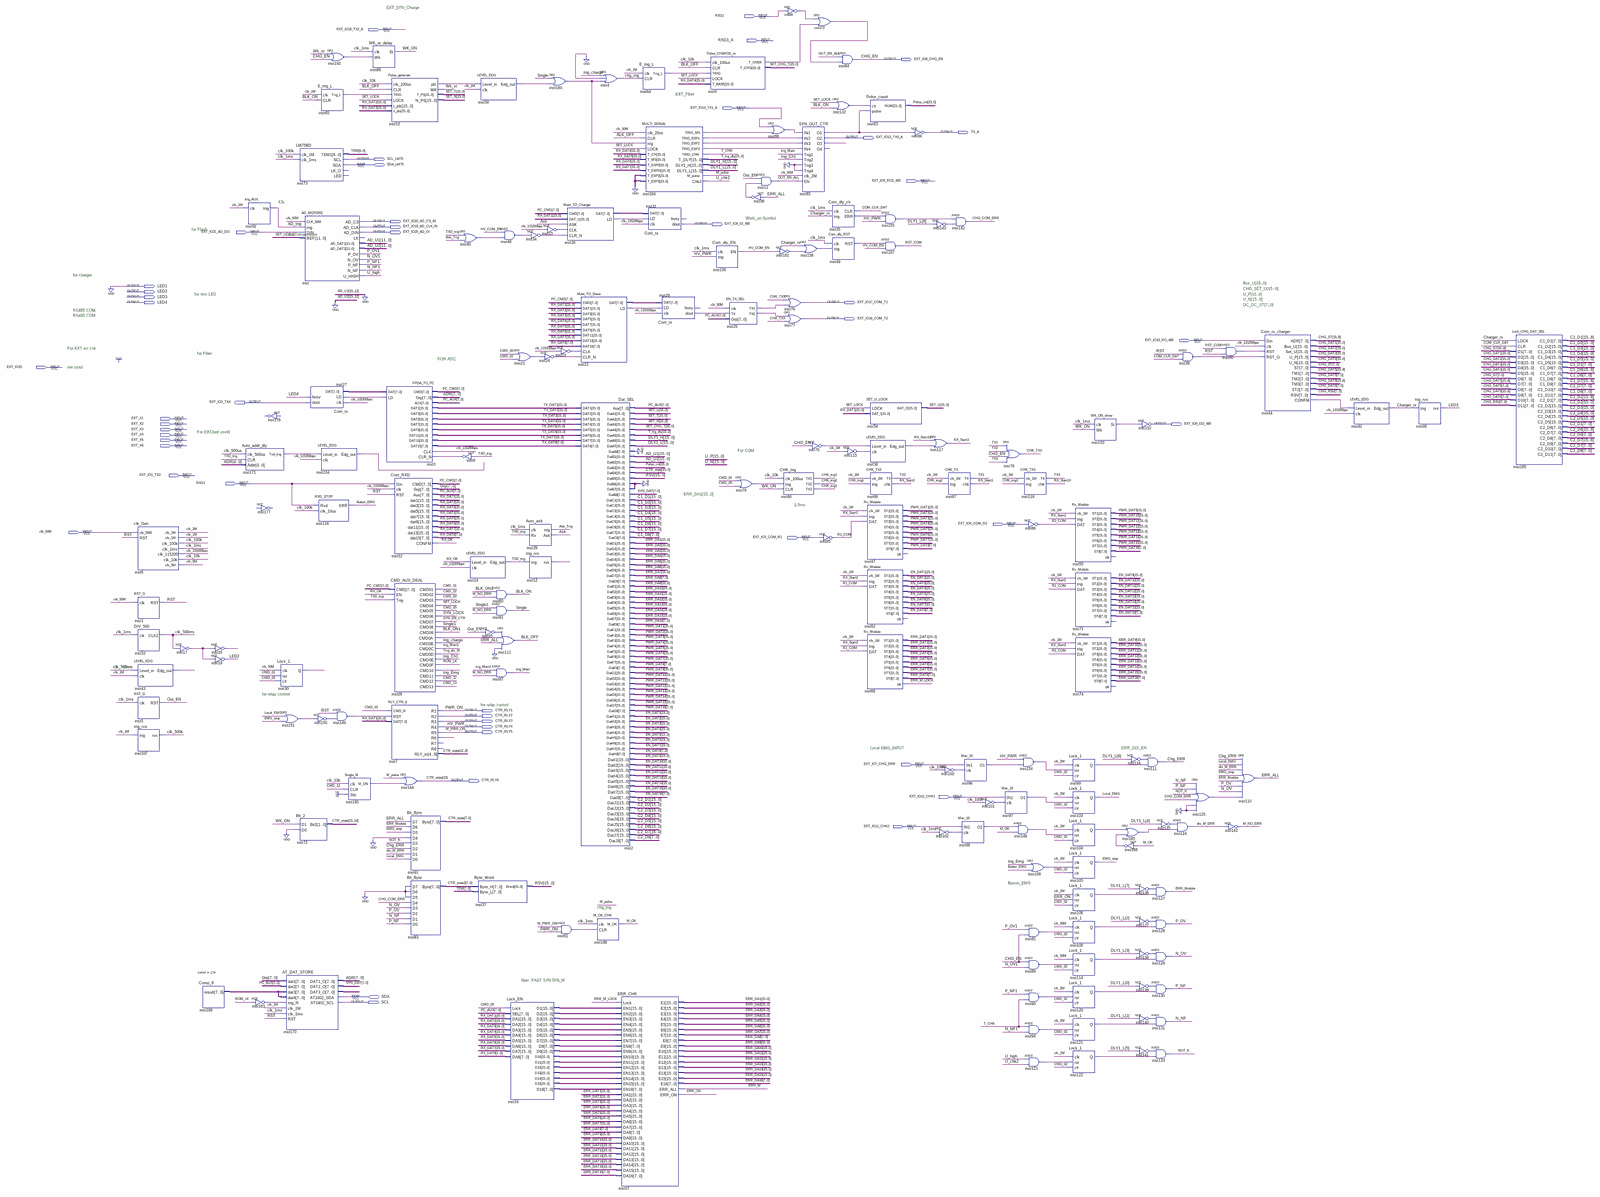
[diagram p0: schematic sheet, whole]
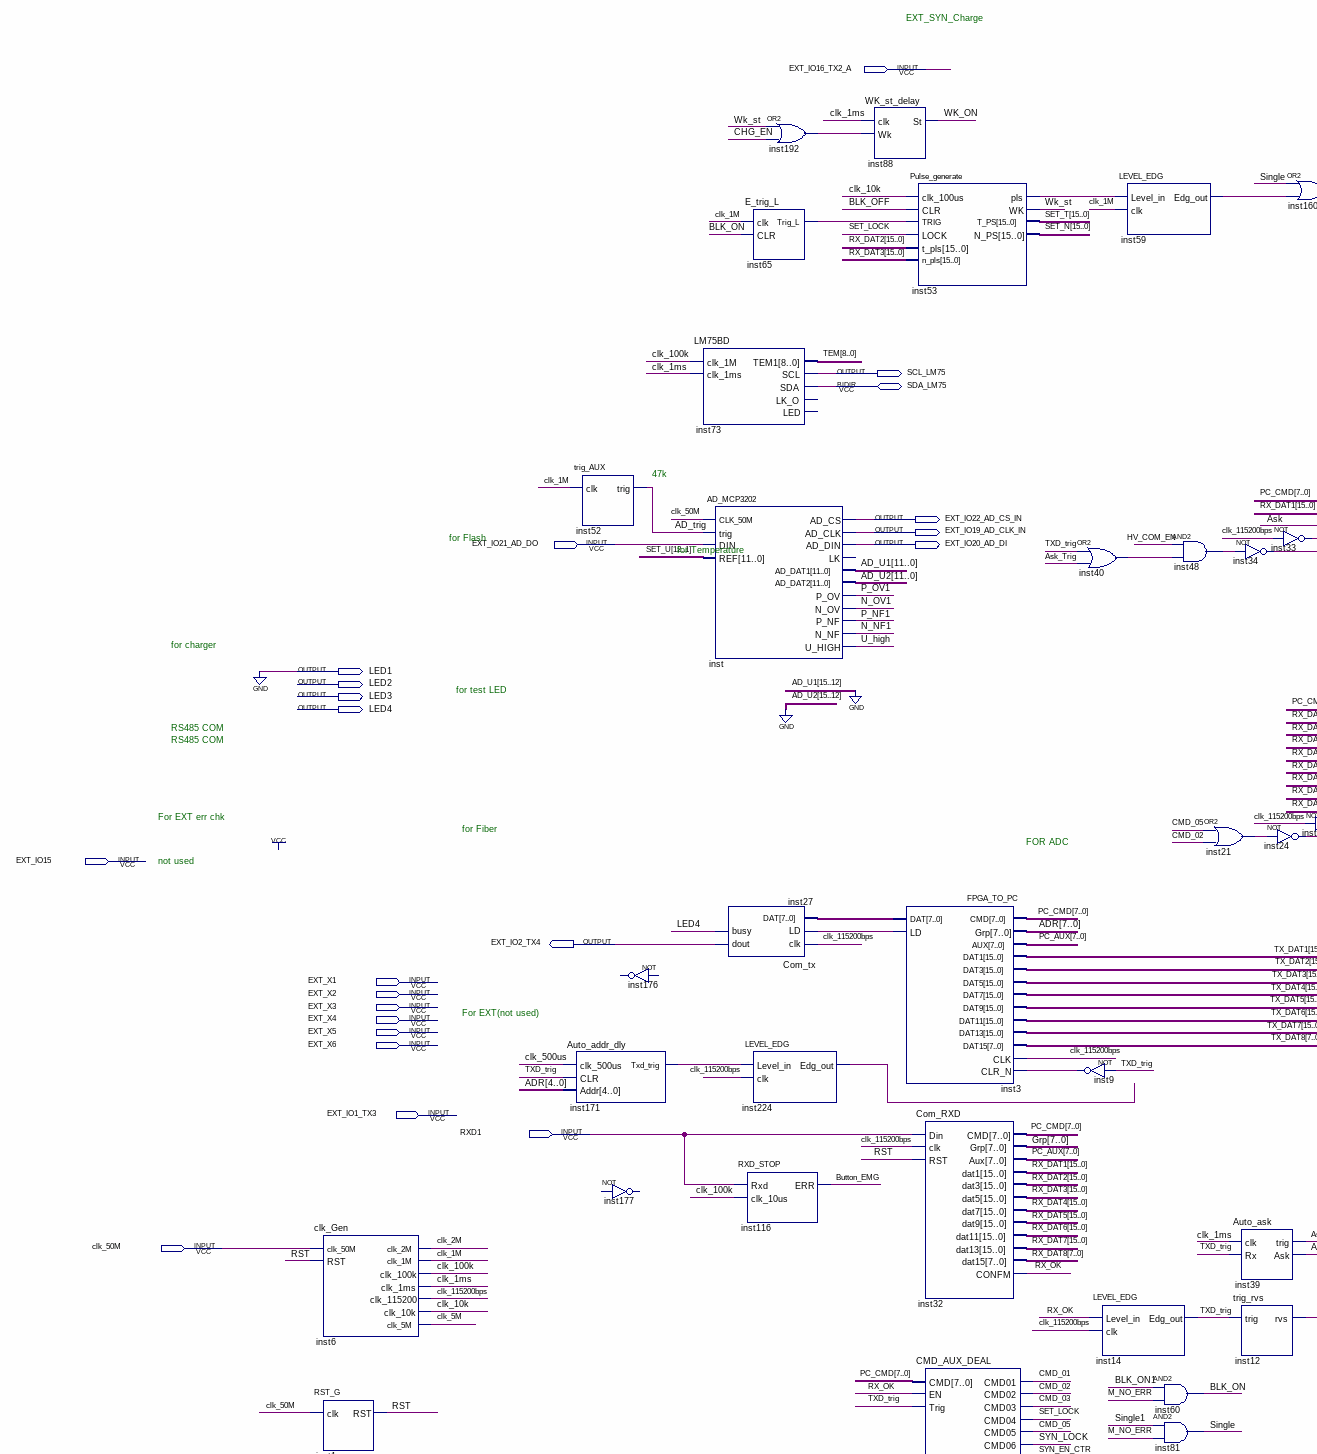
[diagram p1: schematic sheet, upper left part]
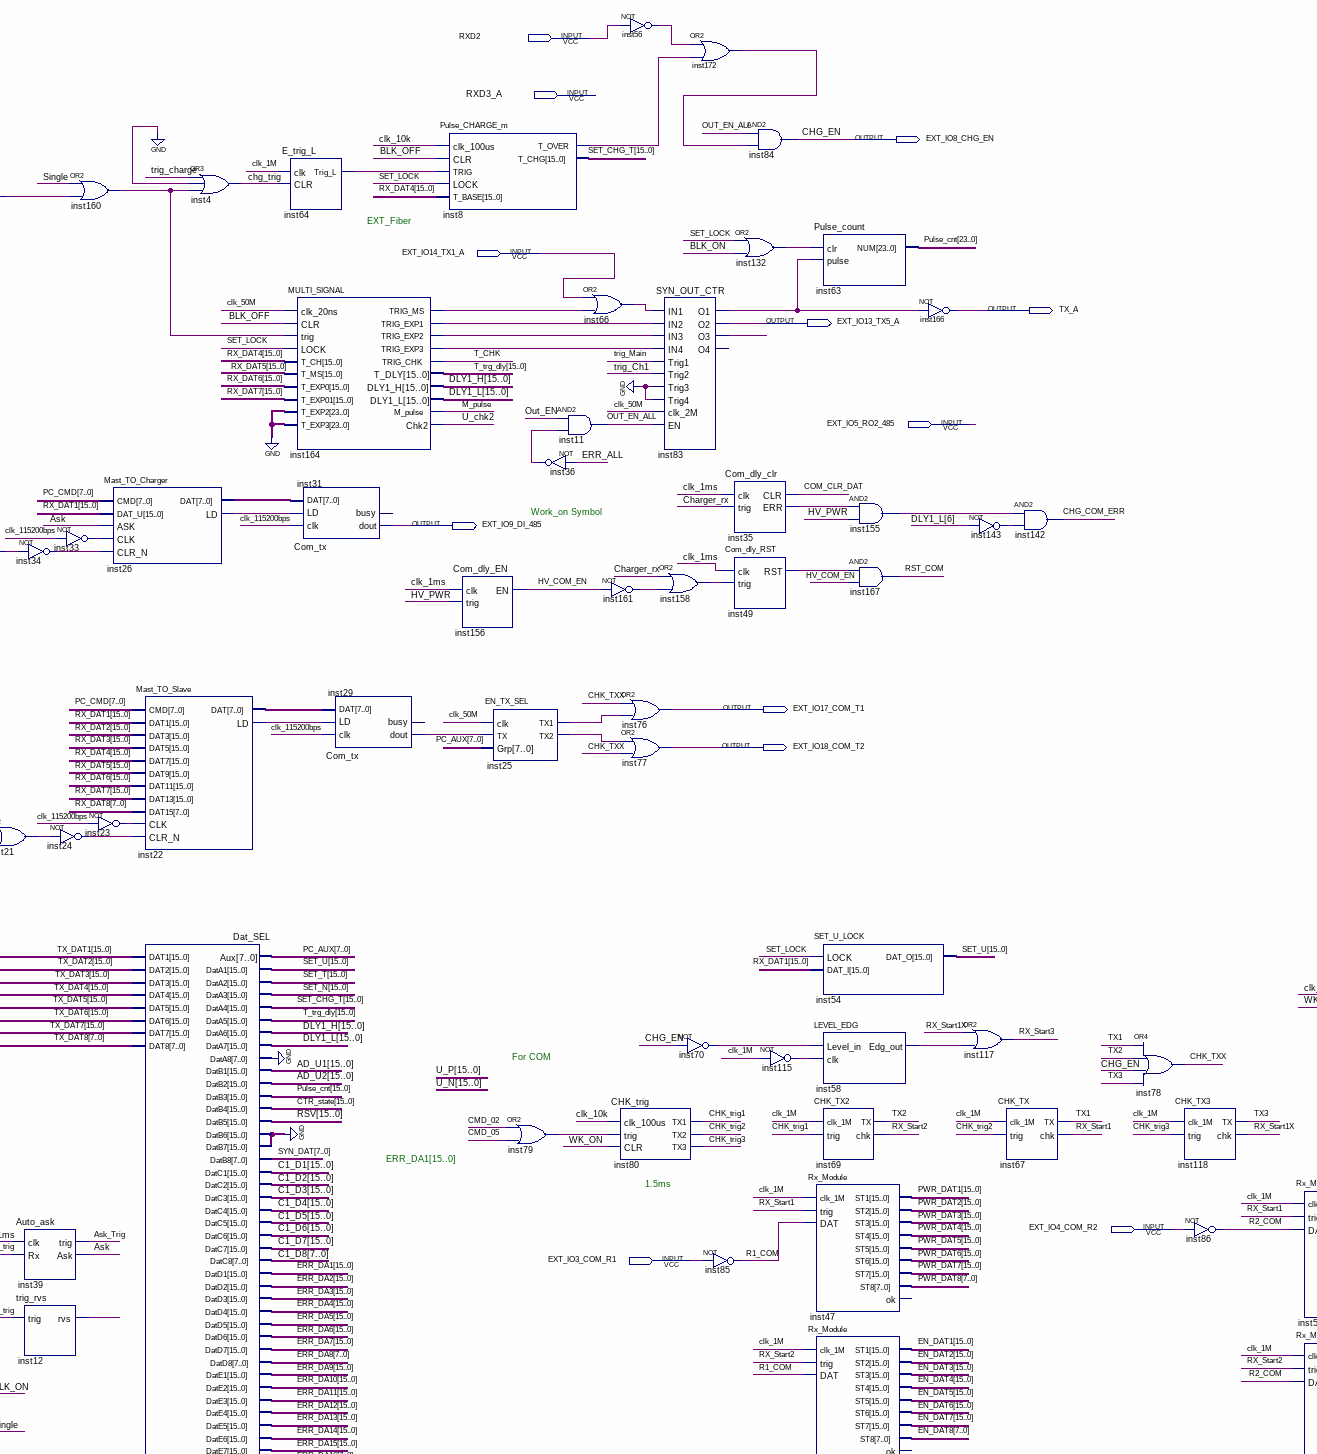
[diagram p2: schematic sheet, upper centre part]
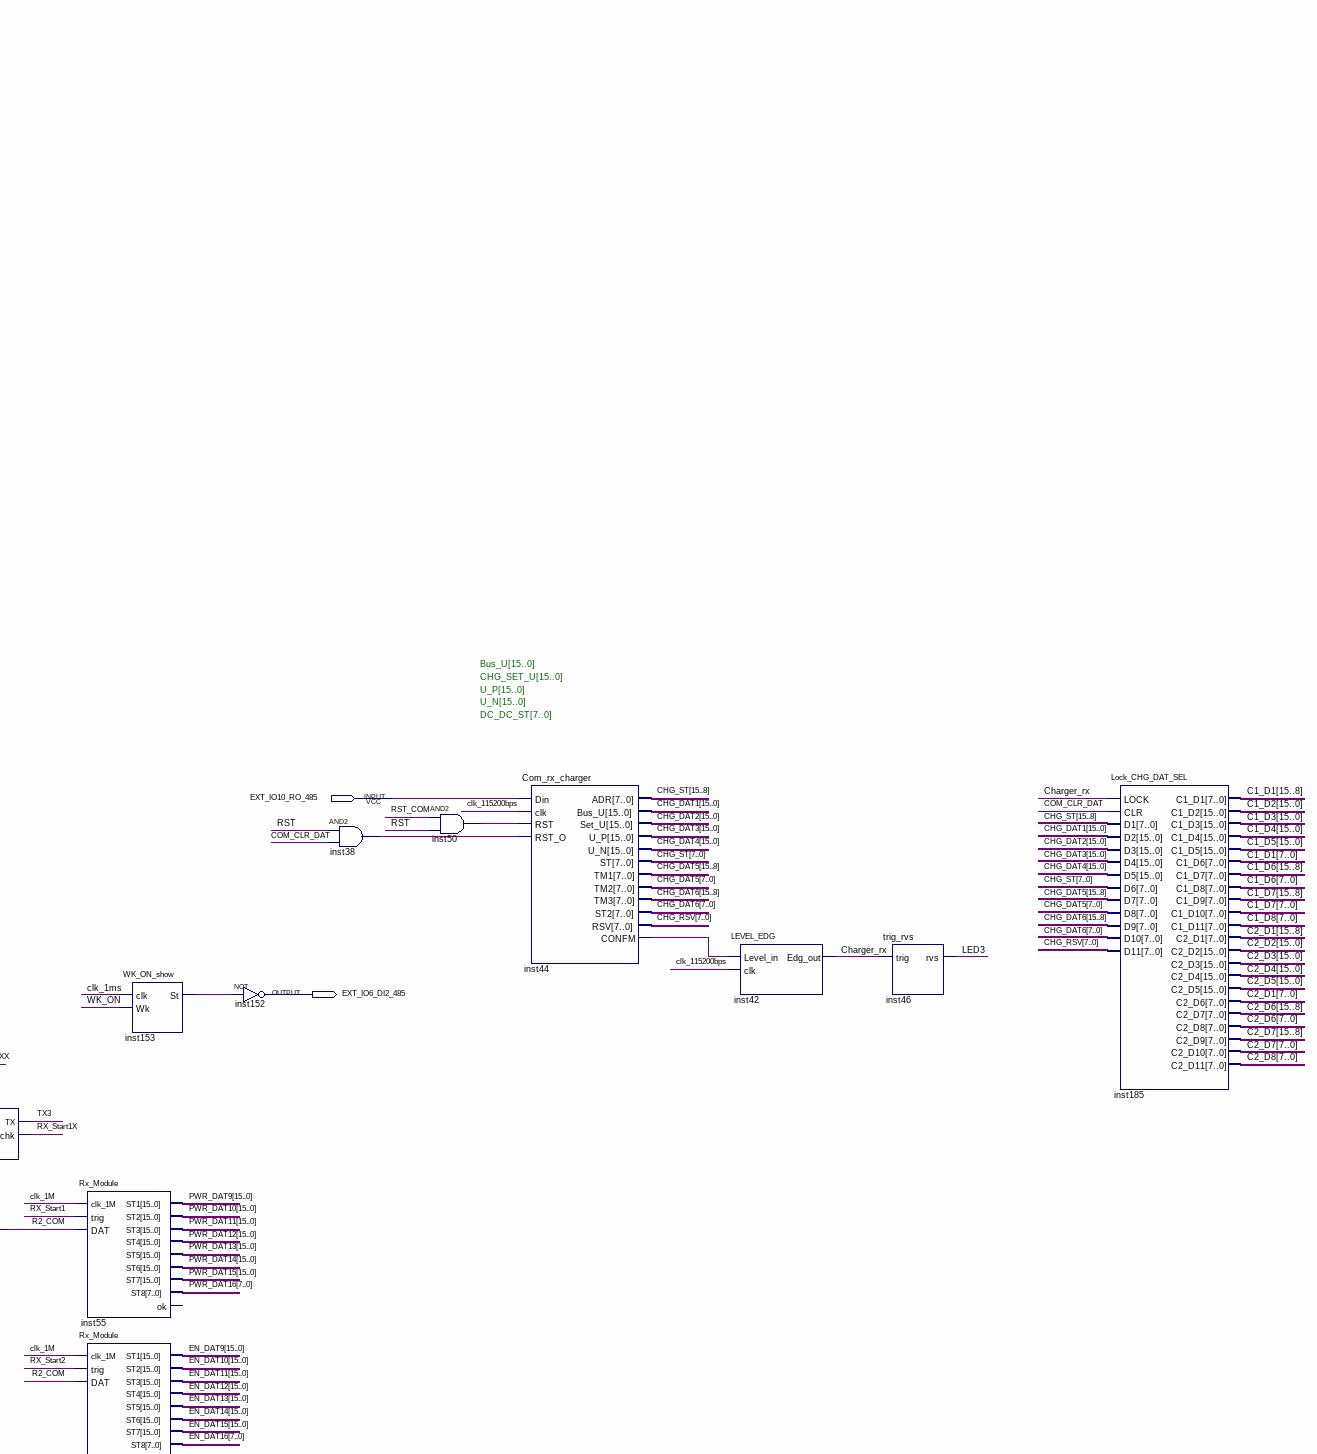
[diagram p3: schematic sheet, upper right part]
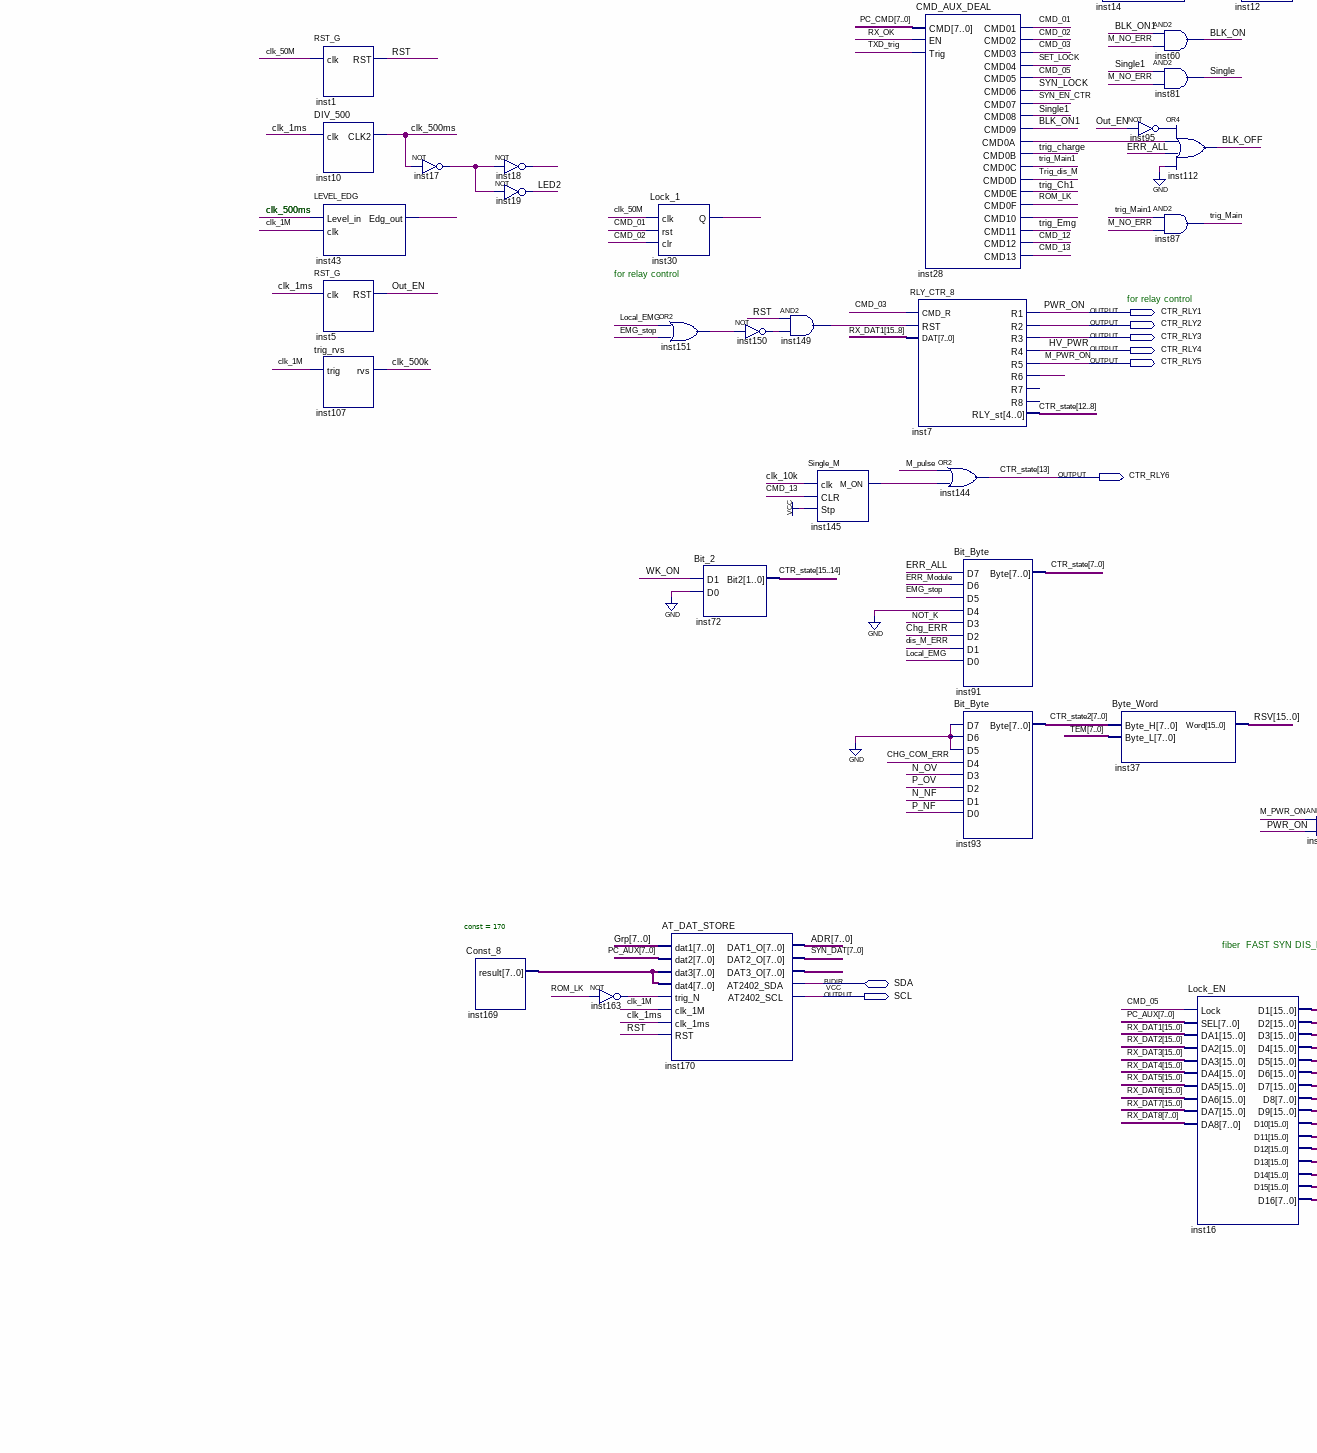
[diagram p4: schematic sheet, lower left part]
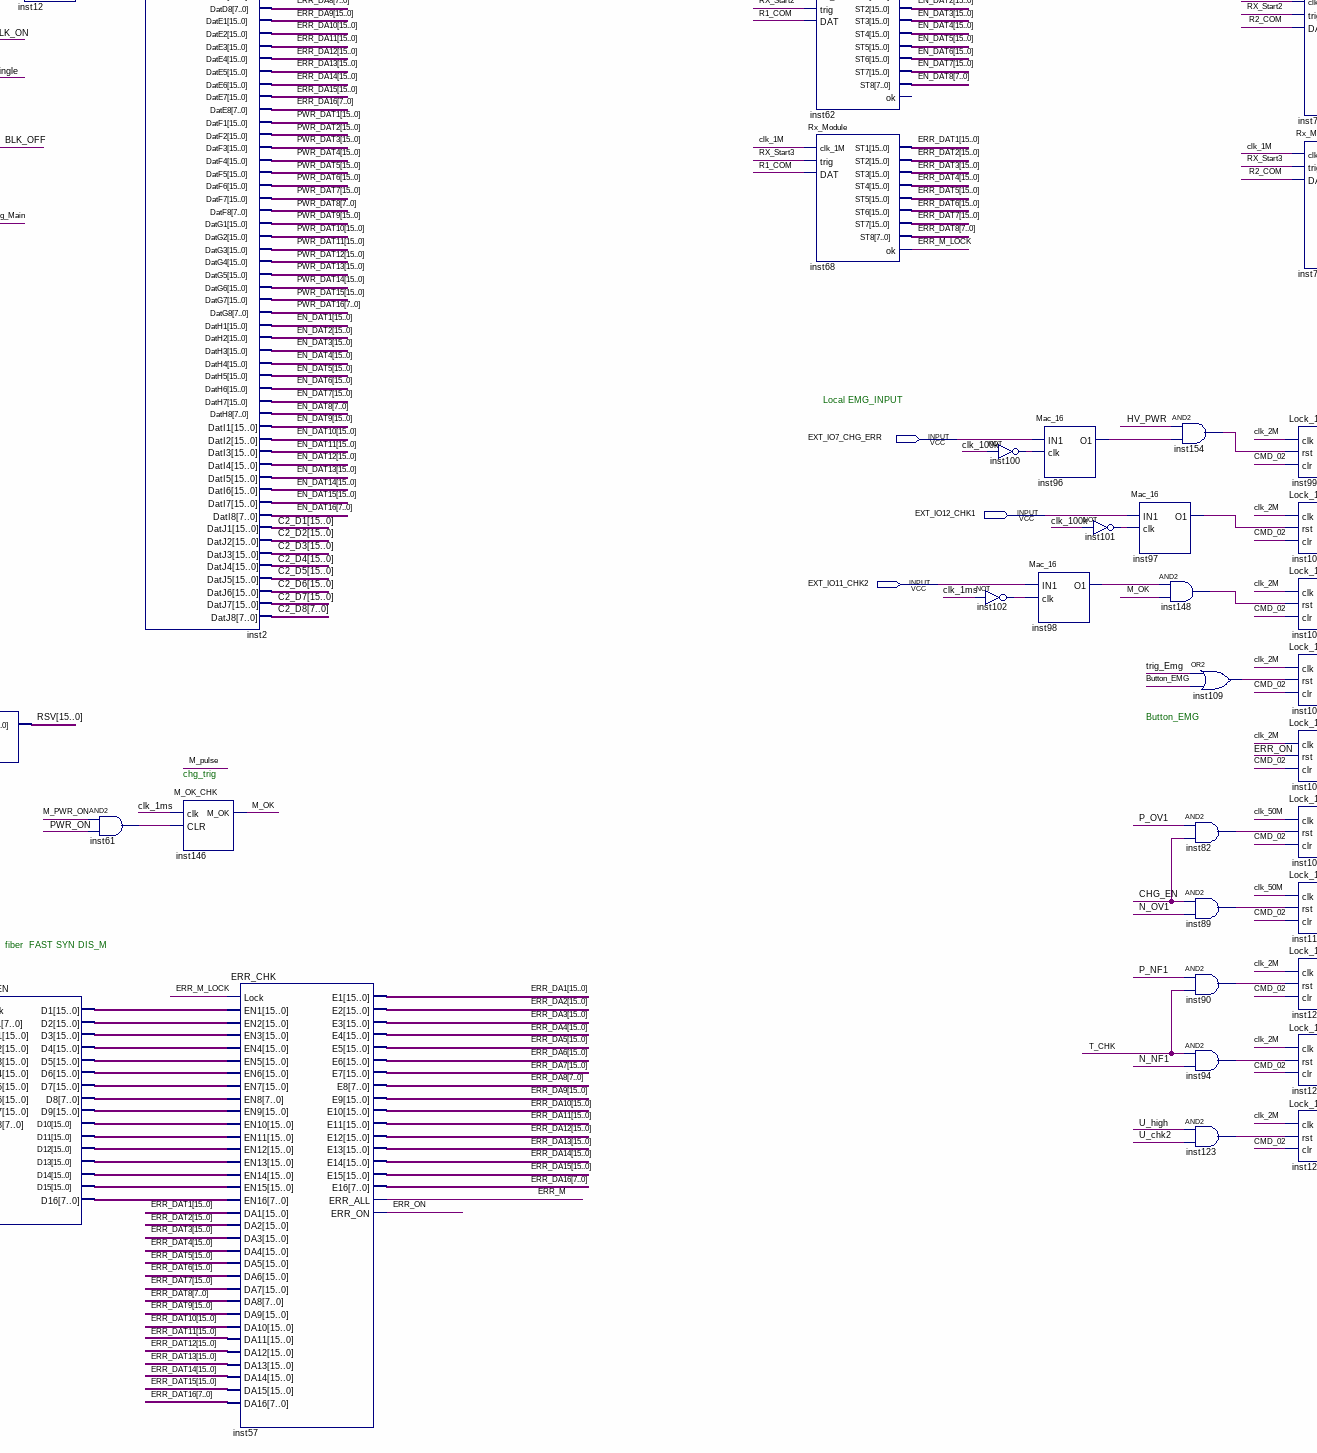
[diagram p5: schematic sheet, lower centre part]
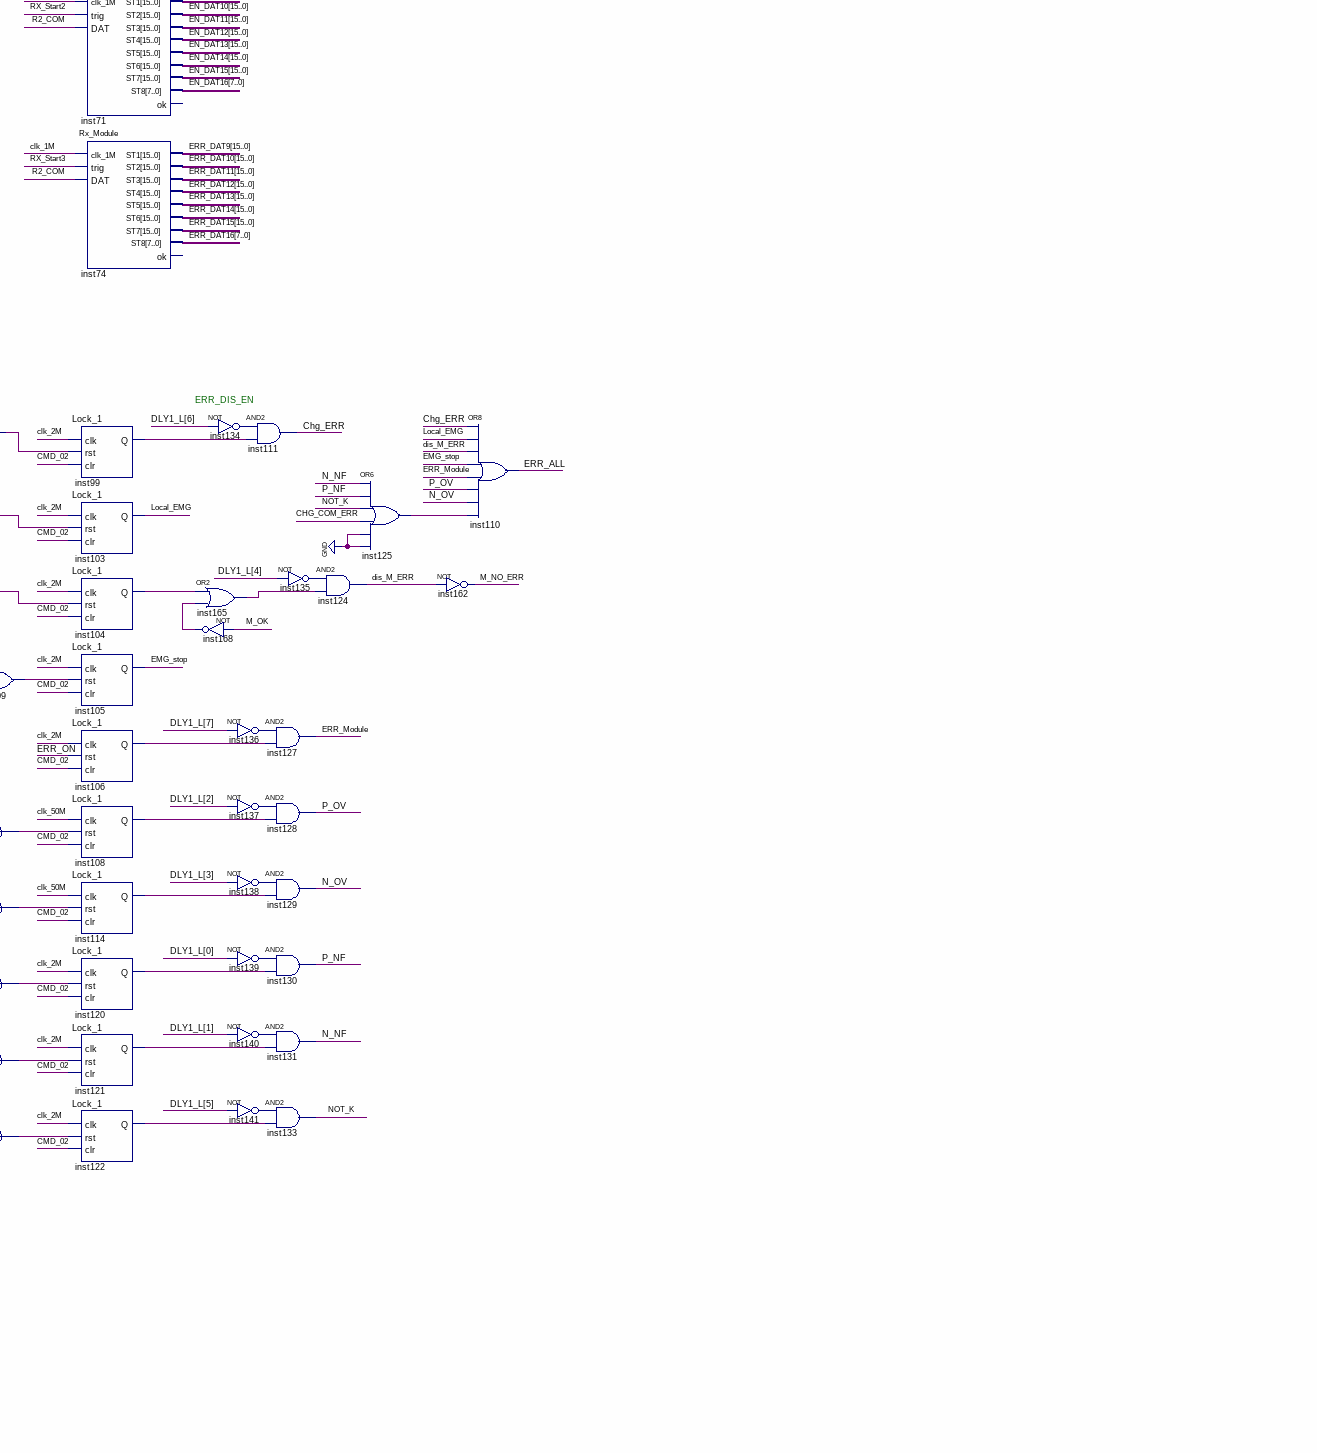
[diagram p6: schematic sheet, lower right part]
// Quartus schematic Top.bdf as structural Verilog: 164 symbols, 47 pins
module Top (
  input  RXD2,
  input  EXT_IO16_TX2_A,
  input  RXD3_A,
  input  EXT_IO14_TX1_A,
  input  EXT_IO5_RO2_485,
  input  EXT_IO21_AD_DO,
  input  EXT_IO10_RO_485,
  input  EXT_IO15,
  input  EXT_X1,
  input  EXT_X2,
  input  EXT_X3,
  input  EXT_X4,
  input  EXT_X5,
  input  EXT_X6,
  input  EXT_IO1_TX3,
  input  RXD1,
  input  EXT_IO4_COM_R2,
  input  clk_50M,
  input  EXT_IO3_COM_R1,
  input  EXT_IO7_CHG_ERR,
  input  EXT_IO12_CHK1,
  input  EXT_IO11_CHK2,
  inout  SDA_LM75,
  inout  SDA,
  output EXT_IO8_CHG_EN,
  output TX_A,
  output EXT_IO13_TX5_A,
  output SCL_LM75,
  output EXT_IO22_AD_CS_IN,
  output EXT_IO9_DI_485,
  output EXT_IO19_AD_CLK_IN,
  output EXT_IO20_AD_DI,
  output LED1,
  output LED2,
  output LED3,
  output LED4,
  output EXT_IO17_COM_T1,
  output EXT_IO18_COM_T2,
  output EXT_IO2_TX4,
  output EXT_IO6_DI2_485,
  output CTR_RLY1,
  output CTR_RLY2,
  output CTR_RLY3,
  output CTR_RLY4,
  output CTR_RLY5,
  output CTR_RLY6,
  output SCL
);

  wire AD_trig, Ask, Ask_Trig, BLK_OFF, BLK_ON, BLK_ON1, Button_EMG, Charger_rx, CHG_COM_ERR, Chg_ERR,
       chg_trig, CHK_trig1, CHK_trig2, CHK_trig3, CHK_TXX, clk_1M, clk_1ms, clk_2M, clk_5M, clk_10k,
       clk_100k, clk_500k, clk_500ms, clk_500us, clk_115200bps, CMD_01, CMD_02, CMD_03, CMD_05, CMD_12,
       CMD_13, COM_CLR_DAT, dis_M_ERR, EMG_stop, ERR_ALL, ERR_M, ERR_M_LOCK, ERR_Module, ERR_ON, HV_COM_EN,
       inst3_ld, inst7_r6, inst8_t_over, inst9_out, inst12_rvs, inst17_out, inst18_out, inst21_out,
       inst22_ld, inst23_out, inst24_out, inst25_tx1, inst25_tx2, inst26_ld, inst28_cmd0a, inst28_cmd10,
       inst29_dout, inst30_q, inst33_out, inst34_out, inst35_err, inst36_out, inst38_out, inst40_out,
       inst43_edg_out, inst44_confm, inst48_out, inst49_rst, inst50_out, inst53_pls, inst56_out,
       inst58_edg_out, inst59_edg_out, inst61_out, inst64_trig_l, inst65_trig_l, inst66_out, inst70_out,
       inst79_out, inst82_out, inst83_o1, inst83_o3, inst89_out, inst90_out, inst94_out, inst95_out,
       inst96_o1, inst97_o1, inst98_o1, inst99_q, inst100_out, inst101_out, inst102_out, inst104_q,
       inst106_q, inst108_q, inst109_out, inst114_q, inst115_out, inst120_q, inst121_q, inst122_q,
       inst123_out, inst125_out, inst132_out, inst134_out, inst135_out, inst136_out, inst137_out,
       inst138_out, inst139_out, inst140_out, inst141_out, inst143_out, inst145_m_on, inst148_out,
       inst149_out, inst150_out, inst151_out, inst153_st, inst154_out, inst155_out, inst158_out, inst160_out,
       inst161_out, inst163_out, inst164_trig_exp1, inst164_trig_exp2, inst164_trig_exp3, inst164_trig_ms,
       inst165_out, inst168_out, inst171_txd_trig, inst172_out, inst192_out, inst224_edg_out, Local_EMG,
       M_NO_ERR, M_OK, M_pulse, N_NF, N_NF1, N_OV, N_OV1, NOT_K, Out_EN, OUT_EN_ALL, P_NF, P_NF1, P_OV,
       P_OV1, R1_COM, R2_COM, ROM_LK, RST, RST_COM, RX_OK, RX_Start1, RX_Start1X, RX_Start2, RX_Start3,
       SET_LOCK, Single, Single1, SYN_EN_CTR, SYN_LOCK, T_CHK, trig_Ch1, trig_charge, Trig_dis_M, trig_Emg,
       trig_Main, trig_Main1, TX1, TX2, TX3, TXD_trig, U_chk2, U_high, WK_ON, Wk_st;
  wire [7:0] ADR, C1_D8, C2_D8, CHG_RSV, CTR_state2, EN_DAT8, EN_DAT16, ERR_DA8, ERR_DA16, ERR_DAT8,
       ERR_DAT16, Grp, inst3_dat, inst16_d8, inst16_d16, inst22_dat, inst26_dat, inst169_result,
       inst170_dat3_o, PC_AUX, PC_CMD, PWR_DAT8, PWR_DAT16, RX_DAT8, SYN_DAT, TX_DAT8;
  wire [8:0] TEM;
  wire [11:0] AD_U1, AD_U2;
  wire [15:0] C1_D1, C1_D2, C1_D3, C1_D4, C1_D5, C1_D6, C1_D7, C2_D1, C2_D2, C2_D3, C2_D4, C2_D5, C2_D6,
       C2_D7, CHG_DAT1, CHG_DAT2, CHG_DAT3, CHG_DAT4, CHG_DAT5, CHG_DAT6, CHG_ST, CTR_state, DLY1_H, DLY1_L,
       EN_DAT1, EN_DAT2, EN_DAT3, EN_DAT4, EN_DAT5, EN_DAT6, EN_DAT7, EN_DAT9, EN_DAT10, EN_DAT11, EN_DAT12,
       EN_DAT13, EN_DAT14, EN_DAT15, ERR_DA1, ERR_DA2, ERR_DA3, ERR_DA4, ERR_DA5, ERR_DA6, ERR_DA7, ERR_DA9,
       ERR_DA10, ERR_DA11, ERR_DA12, ERR_DA13, ERR_DA14, ERR_DA15, ERR_DAT1, ERR_DAT2, ERR_DAT3, ERR_DAT4,
       ERR_DAT5, ERR_DAT6, ERR_DAT7, ERR_DAT9, ERR_DAT10, ERR_DAT11, ERR_DAT12, ERR_DAT13, ERR_DAT14,
       ERR_DAT15, inst16_d1, inst16_d2, inst16_d3, inst16_d4, inst16_d5, inst16_d6, inst16_d7, inst16_d9,
       inst16_d10, inst16_d11, inst16_d12, inst16_d13, inst16_d14, inst16_d15, PWR_DAT1, PWR_DAT2, PWR_DAT3,
       PWR_DAT4, PWR_DAT5, PWR_DAT6, PWR_DAT7, PWR_DAT9, PWR_DAT10, PWR_DAT11, PWR_DAT12, PWR_DAT13,
       PWR_DAT14, PWR_DAT15, RSV, RX_DAT1, RX_DAT2, RX_DAT3, RX_DAT4, RX_DAT5, RX_DAT6, RX_DAT7, SET_CHG_T,
       SET_N, SET_T, SET_U, T_trg_dly, TX_DAT1, TX_DAT2, TX_DAT3, TX_DAT4, TX_DAT5, TX_DAT6, TX_DAT7;
  wire [23:0] Pulse_cnt;

  clk_Gen inst6 (
    .clk_50M(clk_50M), .RST(RST), .clk_2M(clk_2M), .clk_1M(clk_1M), .clk_100k(clk_100k), .clk_1ms(clk_1ms),
    .clk_115200(clk_115200bps), .clk_10k(clk_10k), .clk_5M(clk_5M));
  RST_G inst1 (.clk(clk_50M), .RST(RST));
  DIV_500 inst10 (.clk(clk_1ms), .CLK2(clk_500ms));
  LEVEL_EDG inst43 (.Level_in(clk_500ms), .clk(clk_1M), .Edg_out(inst43_edg_out));
  RST_G inst5 (.clk(clk_1ms), .RST(Out_EN));
  trig_rvs inst107 (.trig(clk_1M), .rvs(clk_500k));
  not inst17 (inst17_out, clk_500ms);
  not inst18 (inst18_out, inst17_out);
  not inst19 (LED2, inst17_out);
  Const_8 #(.\const (170)) inst169 (.result(inst169_result));
  trig_AUX inst52 (.clk(clk_1M), .trig(AD_trig));
  Auto_addr_dly inst171 (.clk_500us(clk_500us), .CLR(TXD_trig), .Addr(ADR[4:0]), .Txd_trig(inst171_txd_trig));
  not inst163 (inst163_out, ROM_LK);
  // NOT inst176 is placed but not wired
  // NOT inst177 is placed but not wired
  Lock_1 inst30 (.clk(clk_50M), .rst(CMD_01), .clr(CMD_02), .Q(inst30_q));
  LM75BD inst73 (.clk_1M(clk_100k), .clk_1ms(clk_1ms), .TEM1(TEM), .SCL(SCL_LM75), .SDA(SDA_LM75));  // open: LK_O, LED
  or inst151 (inst151_out, Local_EMG, EMG_stop);
  Bit_2 inst72 (.D1(WK_ON), .D0(1'b0), .Bit2(CTR_state[15:14]));
  AT_DAT_STORE inst170 (
    .dat1(Grp), .dat2(PC_AUX), .dat3(inst169_result), .dat4(inst169_result), .trig_N(inst163_out),
    .clk_1M(clk_1M), .clk_1ms(clk_1ms), .RST(RST), .DAT1_O(ADR), .DAT2_O(SYN_DAT), .DAT3_O(inst170_dat3_o),
    .AT2402_SCL(SCL), .AT2402_SDA(SDA));
  E_trig_L inst65 (.clk(clk_1M), .CLR(BLK_ON), .Trig_L(inst65_trig_l));
  AD_MCP3202 inst (
    .CLK_50M(clk_50M), .trig(AD_trig), .DIN(EXT_IO21_AD_DO), .REF(SET_U[12:1]), .AD_CS(EXT_IO22_AD_CS_IN),
    .AD_CLK(EXT_IO19_AD_CLK_IN), .AD_DIN(EXT_IO20_AD_DI), .AD_DAT1(AD_U1), .AD_DAT2(AD_U2), .P_OV(P_OV1),
    .N_OV(N_OV1), .P_NF(P_NF1), .N_NF(N_NF1), .U_HIGH(U_high));  // open: LK
  Com_tx inst27 (.clk(clk_115200bps), .LD(inst3_ld), .DAT(inst3_dat), .dout(EXT_IO2_TX4), .busy(LED4));
  LEVEL_EDG inst224 (.Level_in(inst171_txd_trig), .clk(clk_115200bps), .Edg_out(inst224_edg_out));
  RXD_STOP inst116 (.Rxd(RXD1), .clk_10us(clk_100k), .ERR(Button_EMG));
  not inst150 (inst150_out, inst151_out);
  or inst192 (inst192_out, Wk_st, EXT_IO8_CHG_EN);
  and inst149 (inst149_out, RST, inst150_out);
  Single_M inst145 (.clk(clk_10k), .CLR(CMD_13), .Stp(1'b1), .M_ON(inst145_m_on));
  WK_st_delay inst88 (.clk(clk_1ms), .Wk(inst192_out), .St(WK_ON));
  FPGA_TO_PC inst3 (
    .CMD(PC_CMD), .Grp(ADR), .AUX(PC_AUX), .DAT1(TX_DAT1), .DAT3(TX_DAT2), .DAT5(TX_DAT3), .DAT7(TX_DAT4),
    .DAT9(TX_DAT5), .DAT11(TX_DAT6), .DAT13(TX_DAT7), .DAT15(TX_DAT8), .CLK(clk_115200bps),
    .CLR_N(inst9_out), .DAT(inst3_dat), .LD(inst3_ld));
  Pulse_generate inst53 (
    .clk_100us(clk_10k), .CLR(BLK_OFF), .TRIG(inst65_trig_l), .LOCK(SET_LOCK), .t_pls(RX_DAT2),
    .n_pls(RX_DAT3), .pls(inst53_pls), .WK(Wk_st), .T_PS(SET_T), .N_PS(SET_N));
  Com_RXD inst32 (
    .Din(RXD1), .clk(clk_115200bps), .RST(RST), .CMD(PC_CMD), .Grp(Grp), .Aux(PC_AUX), .dat1(RX_DAT1),
    .dat3(RX_DAT2), .dat5(RX_DAT3), .dat7(RX_DAT4), .dat9(RX_DAT5), .dat11(RX_DAT6), .dat13(RX_DAT7),
    .dat15(RX_DAT8), .CONFM(RX_OK));
  CMD_AUX_DEAL inst28 (
    .CMD(PC_CMD), .EN(RX_OK), .Trig(TXD_trig), .CMD01(CMD_01), .CMD02(CMD_02), .CMD03(CMD_03),
    .CMD04(SET_LOCK), .CMD05(CMD_05), .CMD06(SYN_LOCK), .CMD07(SYN_EN_CTR), .CMD08(Single1), .CMD09(BLK_ON1),
    .CMD0A(inst28_cmd0a), .CMD0B(trig_charge), .CMD0C(trig_Main1), .CMD0D(Trig_dis_M), .CMD0E(trig_Ch1),
    .CMD0F(ROM_LK), .CMD10(inst28_cmd10), .CMD11(trig_Emg), .CMD12(CMD_12), .CMD13(CMD_13));
  RLY_CTR_8 inst7 (
    .CMD_R(CMD_03), .RST(inst149_out), .DAT(RX_DAT1[15:8]), .R1(CTR_RLY1), .R2(CTR_RLY2), .R3(CTR_RLY3),
    .R4(CTR_RLY4), .R5(CTR_RLY5), .R6(inst7_r6), .RLY_st(CTR_state[12:8]));  // open: R7, R8
  or inst144 (CTR_RLY6, M_pulse, inst145_m_on);
  Bit_Byte inst91 (
    .D7(ERR_ALL), .D6(ERR_Module), .D5(EMG_stop), .D4(1'b0), .D3(NOT_K), .D2(Chg_ERR), .D1(dis_M_ERR),
    .D0(Local_EMG), .Byte(CTR_state[7:0]));
  Bit_Byte inst93 (
    .D7(1'b0), .D6(1'b0), .D5(1'b0), .D4(CHG_COM_ERR), .D3(N_OV), .D2(P_OV), .D1(N_NF), .D0(P_NF),
    .Byte(CTR_state2));
  or inst40 (inst40_out, TXD_trig, Ask_Trig);
  not inst9 (inst9_out, TXD_trig);
  LEVEL_EDG inst14 (.Level_in(RX_OK), .clk(clk_115200bps), .Edg_out(TXD_trig));
  LEVEL_EDG inst59 (.Level_in(inst53_pls), .clk(clk_1M), .Edg_out(inst59_edg_out));
  and inst60 (BLK_ON, BLK_ON1, M_NO_ERR);
  and inst81 (Single, Single1, M_NO_ERR);
  not inst95 (inst95_out, Out_EN);
  and inst87 (trig_Main, trig_Main1, M_NO_ERR);
  Byte_Word inst37 (.Byte_H(CTR_state2), .Byte_L(TEM[7:0]), .Word(RSV));
  and inst48 (inst48_out, HV_COM_EN, inst40_out);
  or inst21 (inst21_out, CMD_05, CMD_02);
  or inst112 (BLK_OFF, inst95_out, inst28_cmd0a, ERR_ALL, 1'b0);
  Lock_EN inst16 (
    .Lock(CMD_05), .SEL(PC_AUX), .DA1(RX_DAT1), .DA2(RX_DAT2), .DA3(RX_DAT3), .DA4(RX_DAT4), .DA5(RX_DAT5),
    .DA6(RX_DAT6), .DA7(RX_DAT7), .DA8(RX_DAT8), .D1(inst16_d1), .D2(inst16_d2), .D3(inst16_d3),
    .D4(inst16_d4), .D5(inst16_d5), .D6(inst16_d6), .D7(inst16_d7), .D8(inst16_d8), .D9(inst16_d9),
    .D10(inst16_d10), .D11(inst16_d11), .D12(inst16_d12), .D13(inst16_d13), .D14(inst16_d14),
    .D15(inst16_d15), .D16(inst16_d16));
  not inst34 (inst34_out, inst48_out);
  Auto_ask inst39 (.clk(clk_1ms), .Rx(TXD_trig), .trig(Ask_Trig), .Ask(Ask));
  trig_rvs inst12 (.trig(TXD_trig), .rvs(inst12_rvs));
  or inst160 (inst160_out, Single, inst59_edg_out);
  not inst33 (inst33_out, clk_115200bps);
  not inst23 (inst23_out, clk_115200bps);
  not inst24 (inst24_out, inst21_out);
  and inst61 (inst61_out, CTR_RLY5, CTR_RLY1);
  Mast_TO_Charger inst26 (
    .CMD(PC_CMD), .DAT_U(RX_DAT1), .ASK(Ask), .CLK(inst33_out), .CLR_N(inst34_out), .DAT(inst26_dat),
    .LD(inst26_ld));
  Mast_TO_Slave inst22 (
    .CMD(PC_CMD), .DAT1(RX_DAT1), .DAT3(RX_DAT2), .DAT5(RX_DAT3), .DAT7(RX_DAT4), .DAT9(RX_DAT5),
    .DAT11(RX_DAT6), .DAT13(RX_DAT7), .DAT15(RX_DAT8), .CLK(inst23_out), .CLR_N(inst24_out),
    .DAT(inst22_dat), .LD(inst22_ld));
  Dat_SEL inst2 (
    .Aux(PC_AUX), .DatA1(SET_U), .DatA2(SET_T), .DatA3(SET_N), .DatA4(SET_CHG_T), .DatA5(T_trg_dly),
    .DatA6(DLY1_H), .DatA7(DLY1_L), .DatA8({8{1'b0}}), .DatB1({4'b0000, AD_U1}), .DatB2({4'b0000, AD_U2}),
    .DatB3(Pulse_cnt[15:0]), .DatB4({CTR_state[15:14], CTR_RLY6, CTR_state[12:0]}), .DatB5(RSV),
    .DatB6({16{1'b0}}), .DatB7({16{1'b0}}), .DatB8(SYN_DAT), .DatC1(C1_D1), .DatC2(C1_D2), .DatC3(C1_D3),
    .DatC4(C1_D4), .DatC5(C1_D5), .DatC6(C1_D6), .DatC7(C1_D7), .DatC8(C1_D8), .DatD1(ERR_DA1),
    .DatD2(ERR_DA2), .DatD3(ERR_DA3), .DatD4(ERR_DA4), .DatD5(ERR_DA5), .DatD6(ERR_DA6), .DatD7(ERR_DA7),
    .DatD8(ERR_DA8), .DatE1(ERR_DA9), .DatE2(ERR_DA10), .DatE3(ERR_DA11), .DatE4(ERR_DA12), .DatE5(ERR_DA13),
    .DatE6(ERR_DA14), .DatE7(ERR_DA15), .DatE8(ERR_DA16), .DatF1(PWR_DAT1), .DatF2(PWR_DAT2),
    .DatF3(PWR_DAT3), .DatF4(PWR_DAT4), .DatF5(PWR_DAT5), .DatF6(PWR_DAT6), .DatF7(PWR_DAT7),
    .DatF8(PWR_DAT8), .DatG1(PWR_DAT9), .DatG2(PWR_DAT10), .DatG3(PWR_DAT11), .DatG4(PWR_DAT12),
    .DatG5(PWR_DAT13), .DatG6(PWR_DAT14), .DatG7(PWR_DAT15), .DatG8(PWR_DAT16), .DatH1(EN_DAT1),
    .DatH2(EN_DAT2), .DatH3(EN_DAT3), .DatH4(EN_DAT4), .DatH5(EN_DAT5), .DatH6(EN_DAT6), .DatH7(EN_DAT7),
    .DatH8(EN_DAT8), .DatI1(EN_DAT9), .DatI2(EN_DAT10), .DatI3(EN_DAT11), .DatI4(EN_DAT12), .DatI5(EN_DAT13),
    .DatI6(EN_DAT14), .DatI7(EN_DAT15), .DatI8(EN_DAT16), .DatJ1(C2_D1), .DatJ2(C2_D2), .DatJ3(C2_D3),
    .DatJ4(C2_D4), .DatJ5(C2_D5), .DatJ6(C2_D6), .DatJ7(C2_D7), .DatJ8(C2_D8), .DAT1(TX_DAT1),
    .DAT2(TX_DAT2), .DAT3(TX_DAT3), .DAT4(TX_DAT4), .DAT5(TX_DAT5), .DAT6(TX_DAT6), .DAT7(TX_DAT7),
    .DAT8(TX_DAT8));
  or inst4 (chg_trig, trig_charge, 1'b0, inst160_out);
  M_OK_CHK inst146 (.clk(clk_1ms), .CLR(inst61_out), .M_OK(M_OK));
  ERR_CHK inst57 (
    .Lock(ERR_M_LOCK), .EN1(inst16_d1), .EN2(inst16_d2), .EN3(inst16_d3), .EN4(inst16_d4), .EN5(inst16_d5),
    .EN6(inst16_d6), .EN7(inst16_d7), .EN8(inst16_d8), .EN9(inst16_d9), .EN10(inst16_d10), .EN11(inst16_d11),
    .EN12(inst16_d12), .EN13(inst16_d13), .EN14(inst16_d14), .EN15(inst16_d15), .EN16(inst16_d16),
    .DA1(ERR_DAT1), .DA2(ERR_DAT2), .DA3(ERR_DAT3), .DA4(ERR_DAT4), .DA5(ERR_DAT5), .DA6(ERR_DAT6),
    .DA7(ERR_DAT7), .DA8(ERR_DAT8), .DA9(ERR_DAT9), .DA10(ERR_DAT10), .DA11(ERR_DAT11), .DA12(ERR_DAT12),
    .DA13(ERR_DAT13), .DA14(ERR_DAT14), .DA15(ERR_DAT15), .DA16(ERR_DAT16), .E1(ERR_DA1), .E2(ERR_DA2),
    .E3(ERR_DA3), .E4(ERR_DA4), .E5(ERR_DA5), .E6(ERR_DA6), .E7(ERR_DA7), .E8(ERR_DA8), .E9(ERR_DA9),
    .E10(ERR_DA10), .E11(ERR_DA11), .E12(ERR_DA12), .E13(ERR_DA13), .E14(ERR_DA14), .E15(ERR_DA15),
    .E16(ERR_DA16), .ERR_ALL(ERR_M), .ERR_ON(ERR_ON));
  E_trig_L inst64 (.clk(clk_1M), .CLR(chg_trig), .Trig_L(inst64_trig_l));
  MULTI_SIGNAL inst164 (
    .clk_20ns(clk_50M), .CLR(BLK_OFF), .trig(inst160_out), .LOCK(SET_LOCK), .T_CH(RX_DAT4), .T_MS(RX_DAT5),
    .T_EXP0(RX_DAT6), .T_EXP01(RX_DAT7), .T_EXP2({24{1'b0}}), .T_EXP3({24{1'b0}}), .TRIG_MS(inst164_trig_ms),
    .TRIG_EXP1(inst164_trig_exp1), .TRIG_EXP2(inst164_trig_exp2), .TRIG_EXP3(inst164_trig_exp3),
    .TRIG_CHK(T_CHK), .T_DLY(T_trg_dly), .DLY1_H(DLY1_H), .DLY1_L(DLY1_L), .M_pulse(M_pulse), .Chk2(U_chk2));
  Com_tx inst31 (.clk(clk_115200bps), .LD(inst26_ld), .DAT(inst26_dat), .dout(EXT_IO9_DI_485));  // open: busy
  Com_tx inst29 (.clk(clk_115200bps), .LD(inst22_ld), .DAT(inst22_dat), .dout(inst29_dout));  // open: busy
  Pulse_CHARGE_m inst8 (
    .clk_100us(clk_10k), .CLR(BLK_OFF), .TRIG(inst64_trig_l), .LOCK(SET_LOCK), .T_BASE(RX_DAT4),
    .T_OVER(inst8_t_over), .T_CHG(SET_CHG_T));
  Com_dly_EN inst156 (.clk(clk_1ms), .trig(CTR_RLY4), .EN(HV_COM_EN));
  EN_TX_SEL inst25 (.clk(clk_50M), .TX(inst29_dout), .Grp(PC_AUX), .TX1(inst25_tx1), .TX2(inst25_tx2));
  not inst36 (inst36_out, ERR_ALL);
  or inst79 (inst79_out, CMD_02, CMD_05);
  or inst66 (inst66_out, EXT_IO14_TX1_A, inst164_trig_ms);
  and inst11 (OUT_EN_ALL, Out_EN, inst36_out);
  not inst56 (inst56_out, RXD2);
  not inst161 (inst161_out, HV_COM_EN);
  or inst76 (EXT_IO17_COM_T1, CHK_TXX, inst25_tx1);
  or inst77 (EXT_IO18_COM_T2, inst25_tx2, CHK_TXX);
  CHK_trig inst80 (
    .clk_100us(clk_10k), .trig(inst79_out), .CLR(WK_ON), .TX1(CHK_trig1), .TX2(CHK_trig2), .TX3(CHK_trig3));
  or inst172 (inst172_out, inst56_out, inst8_t_over);
  SYN_OUT_CTR inst83 (
    .IN1(inst66_out), .IN2(inst164_trig_exp1), .IN3(inst164_trig_exp2), .IN4(inst164_trig_exp3),
    .Trig1(trig_Main), .Trig2(trig_Ch1), .Trig3(1'b0), .Trig4(1'b0), .clk_2M(clk_50M), .EN(OUT_EN_ALL),
    .O1(inst83_o1), .O2(EXT_IO13_TX5_A), .O3(inst83_o3));  // open: O4
  or inst158 (inst158_out, Charger_rx, inst161_out);
  not inst70 (inst70_out, EXT_IO8_CHG_EN);
  and inst84 (EXT_IO8_CHG_EN, OUT_EN_ALL, inst172_out);
  or inst132 (inst132_out, SET_LOCK, BLK_ON);
  Com_dly_clr inst35 (.clk(clk_1ms), .trig(Charger_rx), .CLR(COM_CLR_DAT), .ERR(inst35_err));
  Com_dly_RST inst49 (.clk(clk_1ms), .trig(inst158_out), .RST(inst49_rst));
  not inst85 (R1_COM, EXT_IO3_COM_R1);
  not inst115 (inst115_out, clk_1M);
  Pulse_count inst63 (.clr(inst132_out), .pulse(inst83_o1), .NUM(Pulse_cnt));
  and inst155 (inst155_out, inst35_err, CTR_RLY4);
  and inst167 (RST_COM, inst49_rst, HV_COM_EN);
  SET_U_LOCK inst54 (.LOCK(SET_LOCK), .DAT_I(RX_DAT1), .DAT_O(SET_U));
  LEVEL_EDG inst58 (.Level_in(inst70_out), .clk(inst115_out), .Edg_out(inst58_edg_out));
  CHK_TX2 inst69 (.clk_1M(clk_1M), .trig(CHK_trig1), .TX(TX2), .chk(RX_Start2));
  Rx_Module inst47 (
    .clk_1M(clk_1M), .trig(RX_Start1), .DAT(R1_COM), .ST1(PWR_DAT1), .ST2(PWR_DAT2), .ST3(PWR_DAT3),
    .ST4(PWR_DAT4), .ST5(PWR_DAT5), .ST6(PWR_DAT6), .ST7(PWR_DAT7), .ST8(PWR_DAT8));  // open: ok
  Rx_Module inst62 (
    .clk_1M(clk_1M), .trig(RX_Start2), .DAT(R1_COM), .ST1(EN_DAT1), .ST2(EN_DAT2), .ST3(EN_DAT3),
    .ST4(EN_DAT4), .ST5(EN_DAT5), .ST6(EN_DAT6), .ST7(EN_DAT7), .ST8(EN_DAT8));  // open: ok
  Rx_Module inst68 (
    .clk_1M(clk_1M), .trig(RX_Start3), .DAT(R1_COM), .ST1(ERR_DAT1), .ST2(ERR_DAT2), .ST3(ERR_DAT3),
    .ST4(ERR_DAT4), .ST5(ERR_DAT5), .ST6(ERR_DAT6), .ST7(ERR_DAT7), .ST8(ERR_DAT8), .ok(ERR_M_LOCK));
  not inst166 (TX_A, inst83_o1);
  not inst143 (inst143_out, DLY1_L[6]);
  or inst117 (RX_Start3, RX_Start1X, inst58_edg_out);
  CHK_TX inst67 (.clk_1M(clk_1M), .trig(CHK_trig2), .TX(TX1), .chk(RX_Start1));
  not inst100 (inst100_out, clk_100k);
  not inst102 (inst102_out, clk_1ms);
  and inst142 (CHG_COM_ERR, inst155_out, inst143_out);
  Mac_16 inst96 (.IN1(EXT_IO7_CHG_ERR), .clk(inst100_out), .O1(inst96_o1));
  Mac_16 inst98 (.IN1(EXT_IO11_CHK2), .clk(inst102_out), .O1(inst98_o1));
  not inst101 (inst101_out, clk_100k);
  or inst78 (CHK_TXX, TX1, TX2, EXT_IO8_CHG_EN, TX3);
  Mac_16 inst97 (.IN1(EXT_IO12_CHK1), .clk(inst101_out), .O1(inst97_o1));
  CHK_TX3 inst118 (.clk_1M(clk_1M), .trig(CHK_trig3), .TX(TX3), .chk(RX_Start1X));
  not inst86 (R2_COM, EXT_IO4_COM_R2);
  and inst154 (inst154_out, CTR_RLY4, inst96_o1);
  and inst148 (inst148_out, inst98_o1, M_OK);
  or inst109 (inst109_out, trig_Emg, Button_EMG);
  and inst82 (inst82_out, P_OV1, EXT_IO8_CHG_EN);
  and inst89 (inst89_out, EXT_IO8_CHG_EN, N_OV1);
  and inst90 (inst90_out, P_NF1, T_CHK);
  and inst94 (inst94_out, T_CHK, N_NF1);
  and inst123 (inst123_out, U_high, U_chk2);
  Rx_Module inst55 (
    .clk_1M(clk_1M), .trig(RX_Start1), .DAT(R2_COM), .ST1(PWR_DAT9), .ST2(PWR_DAT10), .ST3(PWR_DAT11),
    .ST4(PWR_DAT12), .ST5(PWR_DAT13), .ST6(PWR_DAT14), .ST7(PWR_DAT15), .ST8(PWR_DAT16));  // open: ok
  Rx_Module inst71 (
    .clk_1M(clk_1M), .trig(RX_Start2), .DAT(R2_COM), .ST1(EN_DAT9), .ST2(EN_DAT10), .ST3(EN_DAT11),
    .ST4(EN_DAT12), .ST5(EN_DAT13), .ST6(EN_DAT14), .ST7(EN_DAT15), .ST8(EN_DAT16));  // open: ok
  Rx_Module inst74 (
    .clk_1M(clk_1M), .trig(RX_Start3), .DAT(R2_COM), .ST1(ERR_DAT9), .ST2(ERR_DAT10), .ST3(ERR_DAT11),
    .ST4(ERR_DAT12), .ST5(ERR_DAT13), .ST6(ERR_DAT14), .ST7(ERR_DAT15), .ST8(ERR_DAT16));  // open: ok
  Lock_1 inst99 (.clk(clk_2M), .rst(inst154_out), .clr(CMD_02), .Q(inst99_q));
  Lock_1 inst103 (.clk(clk_2M), .rst(inst97_o1), .clr(CMD_02), .Q(Local_EMG));
  Lock_1 inst104 (.clk(clk_2M), .rst(inst148_out), .clr(CMD_02), .Q(inst104_q));
  Lock_1 inst105 (.clk(clk_2M), .rst(inst109_out), .clr(CMD_02), .Q(EMG_stop));
  Lock_1 inst106 (.clk(clk_2M), .rst(ERR_ON), .clr(CMD_02), .Q(inst106_q));
  Lock_1 inst108 (.clk(clk_50M), .rst(inst82_out), .clr(CMD_02), .Q(inst108_q));
  Lock_1 inst114 (.clk(clk_50M), .rst(inst89_out), .clr(CMD_02), .Q(inst114_q));
  Lock_1 inst120 (.clk(clk_2M), .rst(inst90_out), .clr(CMD_02), .Q(inst120_q));
  Lock_1 inst121 (.clk(clk_2M), .rst(inst94_out), .clr(CMD_02), .Q(inst121_q));
  Lock_1 inst122 (.clk(clk_2M), .rst(inst123_out), .clr(CMD_02), .Q(inst122_q));
  WK_ON_show inst153 (.clk(clk_1ms), .Wk(WK_ON), .St(inst153_st));
  not inst152 (EXT_IO6_DI2_485, inst153_st);
  not inst134 (inst134_out, DLY1_L[6]);
  or inst165 (inst165_out, inst104_q, inst168_out);
  not inst168 (inst168_out, M_OK);
  not inst136 (inst136_out, DLY1_L[7]);
  not inst137 (inst137_out, DLY1_L[2]);
  not inst138 (inst138_out, DLY1_L[3]);
  not inst139 (inst139_out, DLY1_L[0]);
  not inst140 (inst140_out, DLY1_L[1]);
  not inst141 (inst141_out, DLY1_L[5]);
  and inst111 (Chg_ERR, inst134_out, inst99_q);
  not inst135 (inst135_out, DLY1_L[4]);
  and inst127 (ERR_Module, inst136_out, inst106_q);
  and inst128 (P_OV, inst137_out, inst108_q);
  and inst129 (N_OV, inst138_out, inst114_q);
  and inst130 (P_NF, inst139_out, inst120_q);
  and inst131 (N_NF, inst140_out, inst121_q);
  and inst133 (NOT_K, inst141_out, inst122_q);
  and inst38 (inst38_out, RST, COM_CLR_DAT);
  and inst124 (dis_M_ERR, inst135_out, inst165_out);
  or inst125 (inst125_out, N_NF, P_NF, NOT_K, CHG_COM_ERR, 1'b0, 1'b0);
  and inst50 (inst50_out, RST_COM, RST);
  not inst162 (M_NO_ERR, dis_M_ERR);
  or inst110 (ERR_ALL, Chg_ERR, Local_EMG, dis_M_ERR, EMG_stop, ERR_Module, P_OV, N_OV, inst125_out);
  Com_rx_charger inst44 (
    .Din(EXT_IO10_RO_485), .clk(clk_115200bps), .RST(inst50_out), .RST_O(inst38_out), .ADR(CHG_ST[15:8]),
    .Bus_U(CHG_DAT1), .Set_U(CHG_DAT2), .U_P(CHG_DAT3), .U_N(CHG_DAT4), .ST(CHG_ST[7:0]),
    .TM1(CHG_DAT5[15:8]), .TM2(CHG_DAT5[7:0]), .TM3(CHG_DAT6[15:8]), .ST2(CHG_DAT6[7:0]), .RSV(CHG_RSV),
    .CONFM(inst44_confm));
  LEVEL_EDG inst42 (.Level_in(inst44_confm), .clk(clk_115200bps), .Edg_out(Charger_rx));
  trig_rvs inst46 (.trig(Charger_rx), .rvs(LED3));
  Lock_CHG_DAT_SEL inst185 (
    .LOCK(Charger_rx), .CLR(COM_CLR_DAT), .D1(CHG_ST[15:8]), .D2(CHG_DAT1), .D3(CHG_DAT2), .D4(CHG_DAT3),
    .D5(CHG_DAT4), .D6(CHG_ST[7:0]), .D7(CHG_DAT5[15:8]), .D8(CHG_DAT5[7:0]), .D9(CHG_DAT6[15:8]),
    .D10(CHG_DAT6[7:0]), .D11(CHG_RSV), .C1_D1(C1_D1[15:8]), .C1_D2(C1_D2), .C1_D3(C1_D3), .C1_D4(C1_D4),
    .C1_D5(C1_D5), .C1_D6(C1_D1[7:0]), .C1_D7(C1_D6[15:8]), .C1_D8(C1_D6[7:0]), .C1_D9(C1_D7[15:8]),
    .C1_D10(C1_D7[7:0]), .C1_D11(C1_D8), .C2_D1(C2_D1[15:8]), .C2_D2(C2_D2), .C2_D3(C2_D3), .C2_D4(C2_D4),
    .C2_D5(C2_D5), .C2_D6(C2_D1[7:0]), .C2_D7(C2_D6[15:8]), .C2_D8(C2_D6[7:0]), .C2_D9(C2_D7[15:8]),
    .C2_D10(C2_D7[7:0]), .C2_D11(C2_D8));

  assign LED1 = 1'b0;

  // Other names for the same wires on the sheet: CHG_EN = EXT_IO8_CHG_EN; CTR_state[13] = CTR_RLY6; HV_PWR = CTR_RLY4;
  //   M_PWR_ON = CTR_RLY5; PWR_ON = CTR_RLY1

  // Notes on the sheet:
  //   EXT_SYN_Charge
  //   EXT_Fiber
  //   47k
  //   Work_on Symbol
  //   for Flash
  //   for Temperature
  //   for charger
  //   Bus_U[15..0]
  //   CHG_SET_U[15..0]
  //   for test LED
  //   U_P[15..0]
  //   U_N[15..0]
  //   DC_DC_ST[7..0]
  //   RS485 COM
  //   RS485 COM
  //   For EXT err chk
  //   for Fiber
  //   FOR ADC
  //   not used
  //   For EXT(not used)
  //   For COM
  //   ERR_DA1[15..0]
  //   1.5ms
  //   clk_500ms
  //   for relay control
  //   for relay control
  //   Local EMG_INPUT
  //   ERR_DIS_EN
  //   Button_EMG
  //   chg_trig
  //   fiber  FAST SYN DIS_M
endmodule
